# EAGLE schematic RJ11-shield (EAGLE 6.5.0)
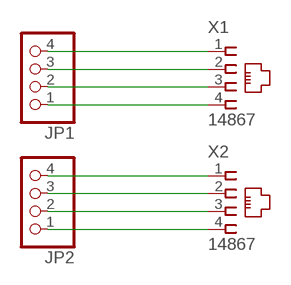
[diagram p0: schematic, sheet 1]

## Parts
JP1  PINHD-1X4  [1X04]
JP2  PINHD-1X4  [1X04]
X1  14867  [14867]
X2  14867  [14867]

## Nets
N$1: JP1.4 X1.1
N$2: JP1.3 X1.2
N$3: JP1.2 X1.3
N$4: JP1.1 X1.4
N$5: JP2.4 X2.1
N$6: JP2.3 X2.2
N$7: JP2.2 X2.3
N$8: JP2.1 X2.4

## Library data of the parts
JP1 JP2 = pinhead:PINHD-1X4: PIN HEADER
X1 X2 = con-4ucon:14867: RJ11 Connector Source: 4UCON TECHNOLOGY INC. 14867.pdf; OC_FARNELL: unknown; OC_NEWARK: unknown